# Altium schematic sheet BSPD.SchDoc
size A4
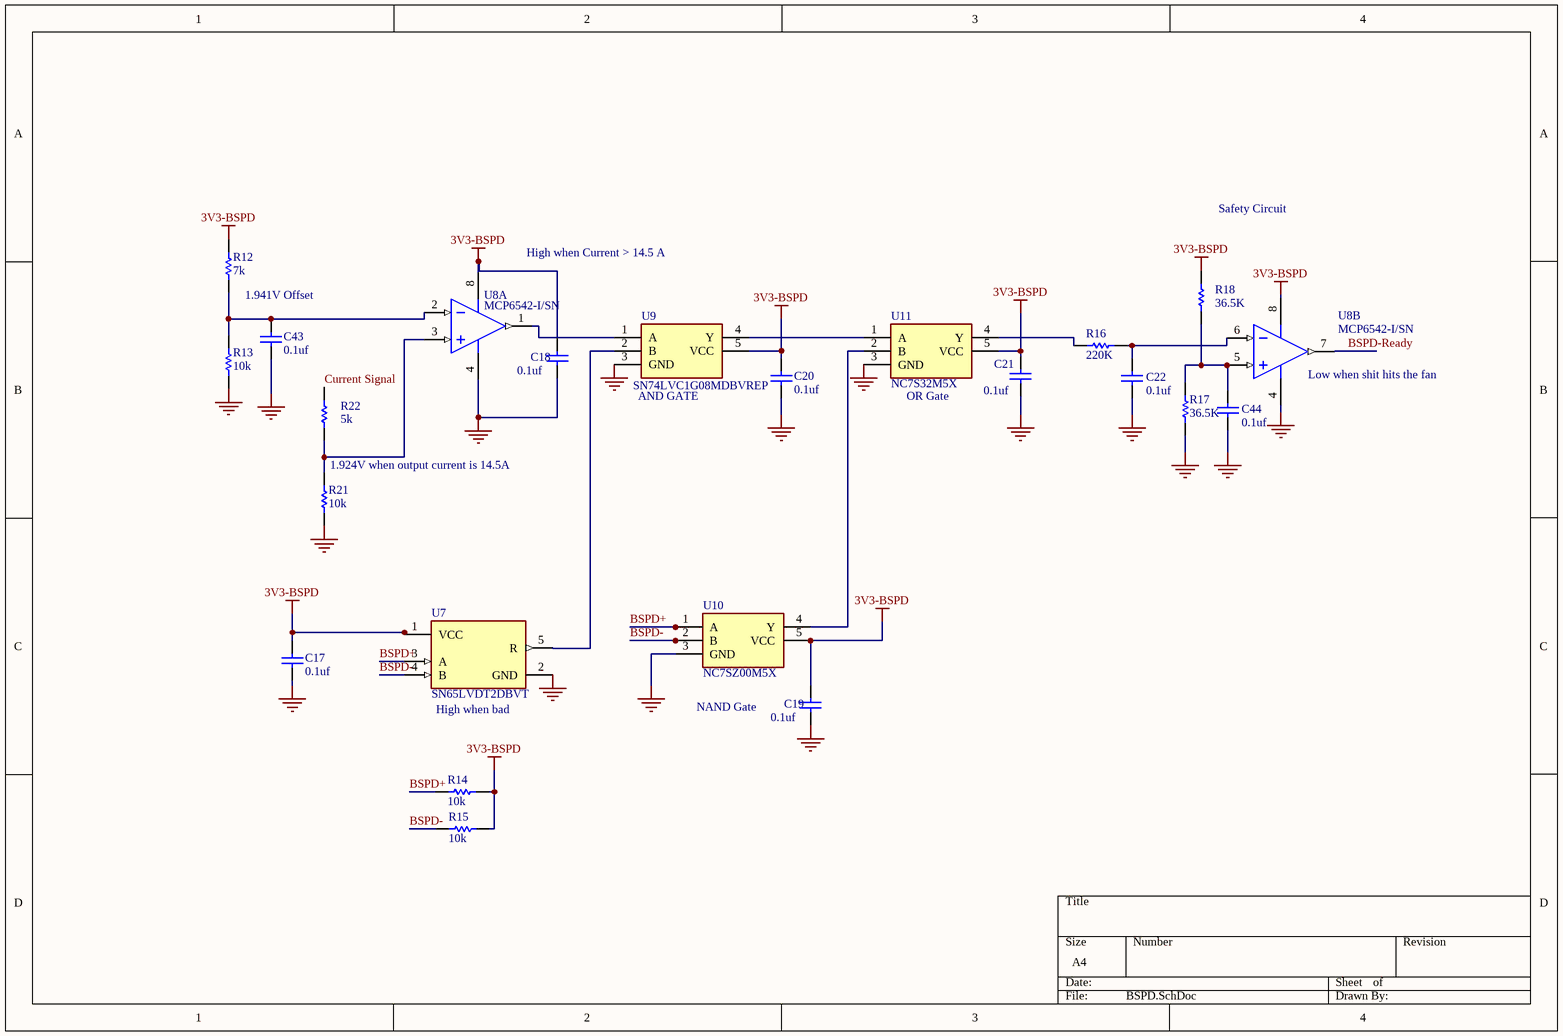
[diagram p0: BSPD.SchDoc]

## Parts
C17  value 0.1uf  [CAPC1608X95N]  (hidden comment: Cap)
C18  value 0.1uf  [CAPC1608X95N]  (hidden comment: Cap)
C19  value 0.1uf  [CAPC1608X95N]  (hidden comment: Cap)
C20  value 0.1uf  [CAPC1608X95N]  (hidden comment: Cap)
C21  value 0.1uf  [CAPC1608X95N]  (hidden comment: Cap)
C22  value 0.1uf  [CAPC1608X95N]  (hidden comment: Cap)
C43  value 0.1uf  [CAPC1608X95N]  (hidden comment: Cap)
C44  value 0.1uf  [CAPC1608X95N]  (hidden comment: Cap)
R12  value 7k  [RESC1608X55N]  (hidden comment: Res1)
R13  value 10k  [RESC1608X55N]  (hidden comment: Res1)
R14  value 10k  [RESC1608X55N]  (hidden comment: Res1)
R15  value 10k  [RESC1608X55N]  (hidden comment: Res1)
R16  value 220K  [RESC1608X55N]  (hidden comment: Res1)
R17  value 36.5K  [RESC1608X55N]  (hidden comment: Res1)
R18  value 36.5K  [RESC1608X55N]  (hidden comment: Res1)
R21  value 10k  [RESC1608X55N]  (hidden comment: Res1)
R22  value 5k  [RESC1608X55N]  (hidden comment: Res1)
U7  SN65LVDT2DBVT  [FP-DBV0005A-MFG]
U8  MCP6542-I/SN  [SOIC-SN8_N]  (parts A,B of 2)
U9  SN74LVC1G08MDBVREP  [SOT95P280X145-5N]
U10  NC7SZ00M5X  [SOT95P280X125-5N]
U11  NC7S32M5X  [SOT95P275X110-5N]

## Nets
3V3-BSPD: C17.2 C18.2 C19.2 C20.2 C21.2 R12.2 R14.2 R15.2 R18.2 U7.1(VCC) U8.8(VDD) U9.5(VCC) U10.5(VCC) U11.5(VCC)
GND: C17.1 C18.1 C19.1 C20.1 C21.1 C22.1 C43.1 C44.1 R13.1 R17.1 R21.1 U7.2(GND) U8.4(VSS) U9.3(GND) U10.3(GND) U11.3(GND)
BSPD+: R14.1 U7.3(A) U10.1(A)
BSPD-: R15.1 U7.4(B) U10.2(B)
BSPD-Ready: U8.7(OUTB)
Current Signal: R22.2
NetC22_2: C22.2 R16.1 U8.6(VINB-)
NetC43_2: C43.2 R12.1 R13.2 U8.2(VINA-)
NetC44_2: C44.2 R17.2 R18.1 U8.5(VINB+)
NetR16_2: R16.2 U11.4(Y)
NetR21_2: R21.2 R22.1 U8.3(VINA+)
NetU7_5: U7.5(R) U9.2(B)
NetU8_1: U8.1(OUTA) U9.1(A)
NetU9_4: U9.4(Y) U11.1(A)
NetU10_4: U10.4(Y) U11.2(B)

## Notes on the sheet
- Safety Circuit
- 1.941V Offset
- (near U8) High when Current > 14.5 A
- (near U8) Low when shit hits the fan
- (near U9) AND GATE
- (near U11) OR Gate
- (near R21) 1.924V when output current is 14.5A
- (near U7) High when bad
- NAND Gate

## Library data of the parts
C17-C22 C43 C44 = Cap: 264-4630; Published: 8-Jun-2000; LatestRevisionDate: 17-Jul-2002; LatestRevisionNote: Re-released for DXP Platform.; PackageReference: RAD-0.3; Publisher: Altium Limited; PackageDescription: Radial Cap, Thru-Hole; 2 Leads; 0.3 in Pin Spacing
R12 R22 = Res1: CRCW06033K24FKEA; Published: 8-Jun-2000; LatestRevisionDate: 17-Jul-2002; LatestRevisionNote: Re-released for DXP Platform.; PackageReference: AXIAL-0.3; Publisher: Altium Limited; PackageDescription: Axial Device, Thru-Hole; 2 Leads; 0.3 in Pin Spacing
R13-R15 R17 R21 = Res1: 169-4216; Published: 8-Jun-2000; LatestRevisionDate: 17-Jul-2002; LatestRevisionNote: Re-released for DXP Platform.; PackageReference: AXIAL-0.3; Publisher: Altium Limited; PackageDescription: Axial Device, Thru-Hole; 2 Leads; 0.3 in Pin Spacing
R16 = Res1: 120-842; Published: 8-Jun-2000; LatestRevisionDate: 17-Jul-2002; LatestRevisionNote: Re-released for DXP Platform.; PackageReference: AXIAL-0.3; Publisher: Altium Limited; PackageDescription: Axial Device, Thru-Hole; 2 Leads; 0.3 in Pin Spacing
R18 = Res1: 679-0260; Published: 8-Jun-2000; LatestRevisionDate: 17-Jul-2002; LatestRevisionNote: Re-released for DXP Platform.; PackageReference: AXIAL-0.3; Publisher: Altium Limited; PackageDescription: Axial Device, Thru-Hole; 2 Leads; 0.3 in Pin Spacing
U7 = CMP-04872-000003-1: IC RECEIVER 0/1 SOT23-5; Manufacturer: Texas Instruments; Max Supply Voltage: 3.6V; Standoff Height: 0mm; Nominal Supply Current: 2-5.5mA; Interface: LVDS,LVTTL; Min Supply Voltage: 2.4V; Device Class L3: unset; Category: IC; Automotive: No; Ambient Temperature Range High: +85°C; Ambient Temperature Range Low: -40°C; Temperature Range Low: -40°C; RoHS: TRUE; ComponentLink2Description: Datasheet; Package: DBV0005A; Device Class L1: Integrated Circuits (ICs); Mouser Description: LVDS Interface IC Dual LVDS; Digikey Description: IC RECEIVER 0/1 SOT23-5; ComponentLink2URL: http://www.ti.com/lit/ds/symlink/sn65lvdt2.pdf; Height: 1.45mm; Temperature: -40°C to +85°C; Temperature Range High: +85°C; Lead Free: Yes; Octopart: https://octopart.com/sn65lvdt2dbvt-texas+instruments-712102; Device Class L2: Interface ICs; Manufacturer Part Number: SN65LVDT2DBVT
U8 = CMP-0187-00180-2: Push-Pull Output Sub-Microamp Comparator, 8-Pin SOIC, Industrial Temperature; PackageReference: SOIC-SN8; PackageVersion: revBB, Aug-2009; ComponentLink3URL: http://www.microchip.com/stellent/groups/techpub_sg/documents/packagingspec/en012702.pdf; Code_JEDEC: MS-012; DatasheetVersion: revH, Dec-2011; ComponentLink1URL: http://www.microchip.com/; ComponentLink2Description: Datasheet; RevisionNote: URLs added. DatasheetVersion updated.; ComponentLink2URL: http://ww1.microchip.com/downloads/en/DeviceDoc/21696H.pdf; ComponentLink3Description: Package Specification; ComponentLink1Description: Manufacturer URL; Code_IPC: SOIC127P600-8; PackageDescription: 8-Lead Plastic Small Outline (SN) - Narrow, 3.90mm Body [SOIC]
U9 = SN74LVC1G08MDBVREP: Integrated Circuit; Manufacturer_Name: Texas Instruments; Datasheet Link: http://www.ti.com/lit/gpn/sn74lvc1g08-ep; Height: 1.45mm; Mouser2 Part Number: 595-SN74LVC08MDBVREP; Mouser2 Price/Stock: https://www.mouser.com/Search/Refine.aspx?Keyword=595-SN74LVC08MDBVREP; Manufacturer_Part_Number: SN74LVC1G08MDBVREP
U10 = NC7S02M5X: NAND GATEEE; Manufacturer_Name: ON Semiconductor; Height: 1.25mm; Manufacturer_Part_Number: NC7S02M5X
U11 = NC7S32M5X: OR GATEEEE; Manufacturer_Name: ON Semiconductor; Datasheet Link: https://componentsearchengine.com/Datasheets/2/NC7S32M5X.pdf; Height: 1.1mm; Manufacturer_Part_Number: NC7S32M5X